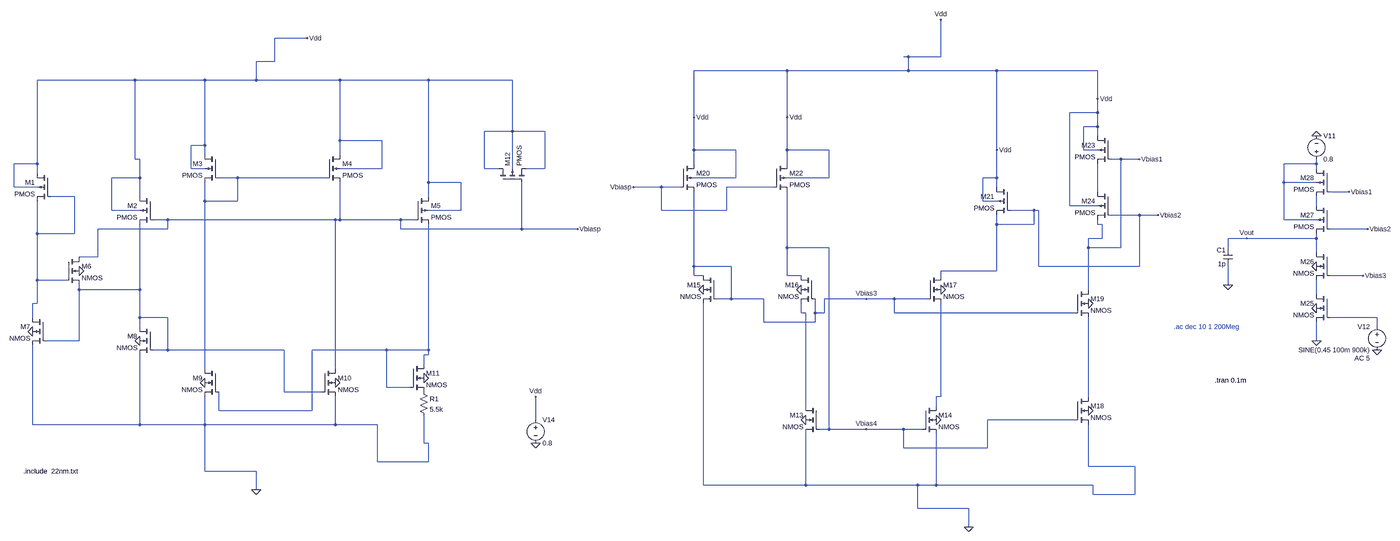
[diagram p0: schematic Project_LTSPICE_22nm.asc, whole sheet]
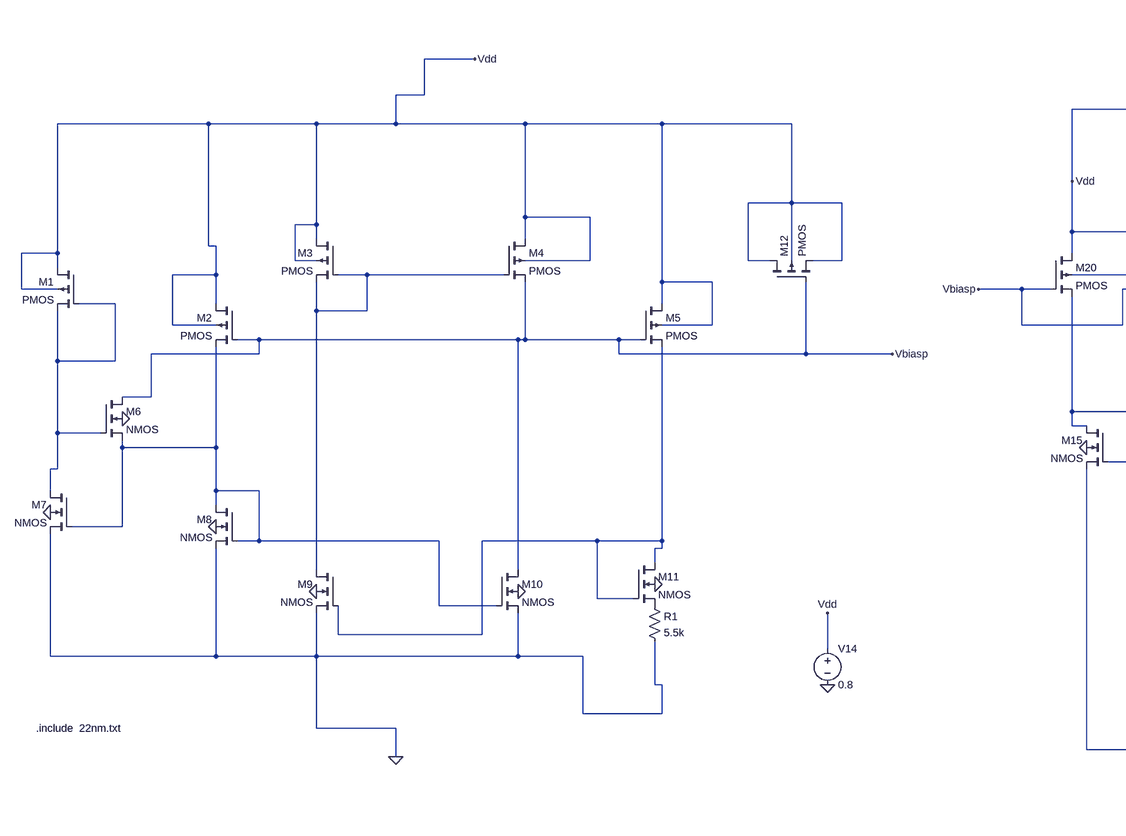
[diagram p1: schematic Project_LTSPICE_22nm.asc, part, row 1 of 1, column 1 of 2]
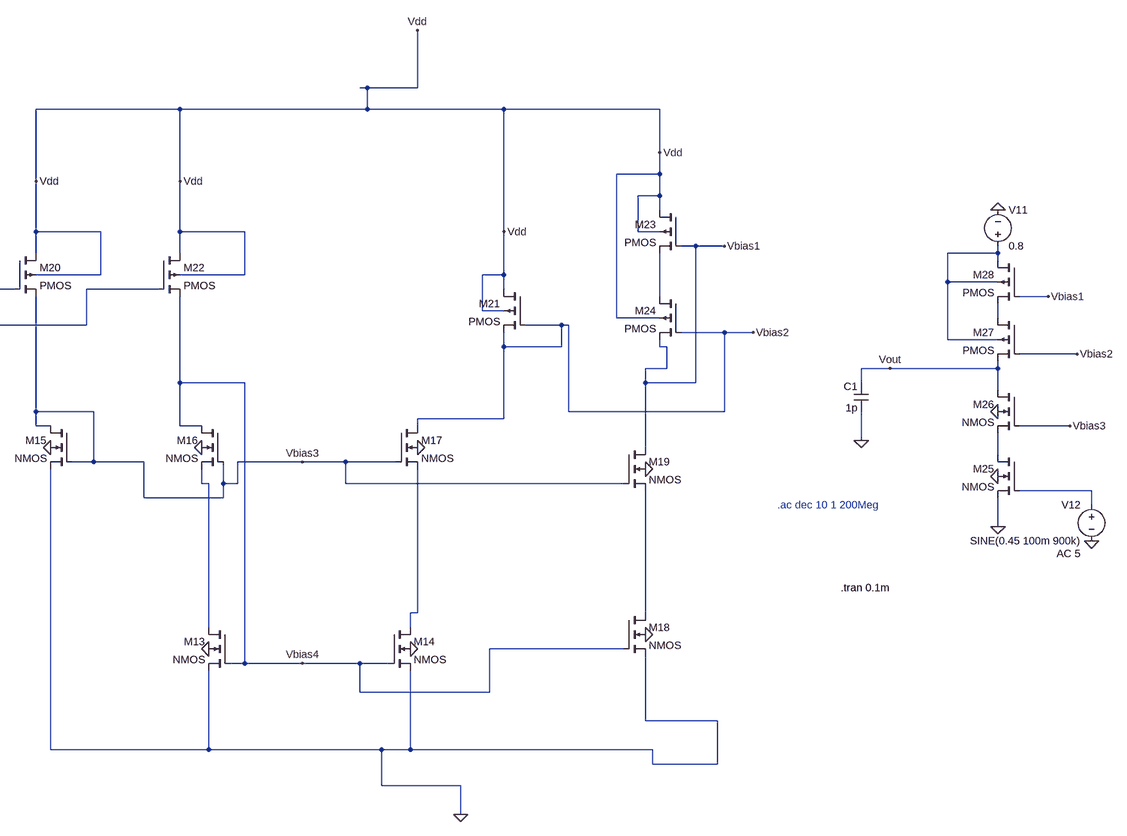
[diagram p2: schematic Project_LTSPICE_22nm.asc, part, row 1 of 1, column 2 of 2]
Project_LTSPICE_22nm.asc, the LTspice schematic file:
Version 4
SHEET 1 6984 1412
WIRE 80 -512 -32 -512
WIRE 2144 -448 2128 -448
WIRE 2256 -448 2256 -576
WIRE 2256 -448 2144 -448
WIRE -32 -432 -32 -512
WIRE -32 -432 -96 -432
WIRE 1728 -400 1408 -400
WIRE 2144 -400 2144 -448
WIRE 2144 -400 1728 -400
WIRE 2448 -400 2144 -400
WIRE 2816 -400 2448 -400
WIRE -512 -368 -848 -368
WIRE -272 -368 -512 -368
WIRE -96 -368 -96 -432
WIRE -96 -368 -272 -368
WIRE 192 -368 -96 -368
WIRE 496 -368 192 -368
WIRE 784 -368 496 -368
WIRE 2816 -304 2816 -400
WIRE 2816 -256 2816 -304
WIRE 2816 -256 2720 -256
WIRE 1408 -240 1408 -400
WIRE 1728 -240 1728 -400
WIRE 2816 -208 2816 -256
WIRE 2816 -208 2768 -208
WIRE 784 -192 784 -368
WIRE 784 -192 688 -192
WIRE 896 -192 784 -192
WIRE 2816 -176 2816 -208
WIRE 192 -160 192 -368
WIRE 336 -160 192 -160
WIRE -272 -144 -272 -368
WIRE -272 -144 -320 -144
WIRE 1408 -128 1408 -240
WIRE 1552 -128 1408 -128
WIRE 1728 -128 1728 -240
WIRE 1872 -128 1728 -128
WIRE 2448 -128 2448 -400
WIRE 2768 -128 2768 -208
WIRE 2816 -128 2768 -128
WIRE -272 -112 -272 -144
WIRE 192 -112 192 -160
WIRE -512 -96 -512 -368
WIRE -496 -96 -512 -96
WIRE 2896 -96 2864 -96
WIRE 2960 -96 2896 -96
WIRE -848 -80 -848 -368
WIRE -848 -80 -928 -80
WIRE 1408 -80 1408 -128
WIRE 1728 -80 1728 -128
WIRE 3568 -80 3568 -96
WIRE 3568 -80 3456 -80
WIRE -320 -64 -320 -144
WIRE -272 -64 -320 -64
WIRE 336 -64 336 -160
WIRE 336 -64 192 -64
WIRE 688 -64 688 -192
WIRE 736 -64 688 -64
WIRE 784 -64 784 -192
WIRE 896 -64 896 -192
WIRE 896 -64 832 -64
WIRE 3568 -64 3568 -80
WIRE -848 -48 -848 -80
WIRE -496 -32 -496 -96
WIRE -496 -32 -592 -32
WIRE -160 -32 -224 -32
WIRE 144 -32 -160 -32
WIRE 1552 -32 1552 -128
WIRE 1552 -32 1408 -32
WIRE 1872 -32 1872 -128
WIRE 1872 -32 1728 -32
WIRE 2448 -32 2448 -128
WIRE 2448 -32 2400 -32
WIRE 496 -16 496 -368
WIRE 608 -16 496 -16
WIRE 3456 -16 3456 -80
WIRE 3568 -16 3456 -16
WIRE -928 0 -928 -80
WIRE -848 0 -928 0
WIRE 1296 0 1200 0
WIRE 1360 0 1296 0
WIRE 1680 0 1520 0
WIRE 2448 0 2448 -32
WIRE 2816 16 2816 -80
WIRE 3680 16 3616 16
WIRE -720 32 -800 32
WIRE -496 32 -496 -32
WIRE 496 32 496 -16
WIRE -272 48 -272 -16
WIRE -160 48 -160 -32
WIRE -160 48 -272 48
WIRE 2400 48 2400 -32
WIRE 2448 48 2400 48
WIRE 2720 64 2720 -256
WIRE 2816 64 2720 64
WIRE 3568 64 3568 32
WIRE -592 80 -592 -32
WIRE -496 80 -592 80
WIRE 608 80 608 -16
WIRE 608 80 496 80
WIRE 1296 80 1296 0
WIRE 1520 80 1520 0
WIRE 1520 80 1296 80
WIRE 2576 80 2496 80
WIRE 2592 80 2576 80
WIRE 2960 96 2864 96
WIRE 3024 96 2960 96
WIRE -400 112 -448 112
WIRE 176 112 -400 112
WIRE 192 112 192 -16
WIRE 192 112 176 112
WIRE 400 112 192 112
WIRE 448 112 400 112
WIRE 3456 112 3456 -16
WIRE 3568 112 3456 112
WIRE 2448 128 2448 96
WIRE 2576 128 2576 80
WIRE 2576 128 2448 128
WIRE 2816 128 2816 112
WIRE 2832 128 2816 128
WIRE -400 144 -400 112
WIRE -400 144 -640 144
WIRE 400 144 400 112
WIRE 816 144 816 -16
WIRE 816 144 400 144
WIRE 1008 144 816 144
WIRE 3744 144 3616 144
WIRE -848 160 -848 48
WIRE -720 160 -720 32
WIRE -720 160 -848 160
WIRE 2832 176 2832 128
WIRE 2832 176 2784 176
WIRE 3328 176 3264 176
WIRE 3568 176 3568 160
WIRE 3568 176 3328 176
WIRE 1728 208 1728 16
WIRE 1872 208 1728 208
WIRE 2784 208 2784 176
WIRE 2896 208 2896 -96
WIRE 2896 208 2784 208
WIRE 3264 208 3264 176
WIRE 3568 224 3568 176
WIRE -640 240 -640 144
WIRE -640 240 -704 240
WIRE 1408 272 1408 16
WIRE 1536 272 1408 272
WIRE 2592 272 2592 80
WIRE 2960 272 2960 96
WIRE 2960 272 2592 272
WIRE 2448 288 2448 128
WIRE 2448 288 2256 288
WIRE 1408 304 1408 272
WIRE 1440 304 1408 304
WIRE 1728 304 1728 208
WIRE 1776 304 1728 304
WIRE 2256 304 2256 288
WIRE 3728 304 3616 304
WIRE -848 320 -848 160
WIRE -752 320 -848 320
WIRE 3264 336 3264 272
WIRE -704 352 -704 336
WIRE -496 352 -496 128
WIRE -496 352 -704 352
WIRE 2784 352 2784 208
WIRE 3568 368 3568 320
WIRE 1536 384 1536 272
WIRE 1536 384 1488 384
WIRE 1648 384 1536 384
WIRE 2000 384 1856 384
WIRE 2096 384 2000 384
WIRE 2208 384 2096 384
WIRE -848 400 -848 320
WIRE -848 400 -864 400
WIRE 1776 432 1776 400
WIRE 1792 432 1776 432
WIRE 1824 432 1824 384
WIRE 1856 432 1856 384
WIRE 1856 432 1824 432
WIRE 2096 432 2096 384
WIRE 2736 432 2096 432
WIRE -864 448 -864 400
WIRE -496 448 -496 352
WIRE -400 448 -496 448
WIRE 3776 448 3616 448
WIRE 1648 464 1648 384
WIRE 1824 464 1824 432
WIRE 1824 464 1648 464
WIRE -496 480 -496 448
WIRE 3776 480 3776 448
WIRE -704 528 -704 352
WIRE -704 528 -816 528
WIRE 3568 528 3568 464
WIRE -400 560 -400 448
WIRE -400 560 -448 560
WIRE 0 560 -400 560
WIRE 352 560 96 560
WIRE 496 560 496 128
WIRE 496 560 352 560
WIRE 496 576 496 560
WIRE 496 576 480 576
WIRE 480 608 480 576
WIRE -272 624 -272 48
WIRE 176 624 176 112
WIRE 352 688 352 560
WIRE 432 688 352 688
WIRE 0 704 0 560
WIRE 128 704 0 704
WIRE 2256 720 2256 400
WIRE 2256 720 2240 720
WIRE 2784 720 2784 448
WIRE 1792 752 1792 432
WIRE 2240 752 2240 720
WIRE -224 768 -224 704
WIRE 96 768 96 560
WIRE 96 768 -224 768
WIRE 864 800 864 720
WIRE 2736 800 2416 800
WIRE -864 816 -864 544
WIRE -496 816 -496 576
WIRE -496 816 -864 816
WIRE -272 816 -272 720
WIRE -272 816 -496 816
WIRE 176 816 176 720
WIRE 176 816 -272 816
WIRE 320 816 176 816
WIRE 1872 832 1872 208
WIRE 1872 832 1840 832
WIRE 2000 832 1872 832
WIRE 2128 832 2000 832
WIRE 2192 832 2128 832
WIRE 480 880 480 784
WIRE 496 880 480 880
WIRE 2128 896 2128 832
WIRE 2416 896 2416 800
WIRE 2416 896 2128 896
WIRE 320 944 320 816
WIRE 496 944 496 880
WIRE 496 944 320 944
WIRE 2784 960 2784 816
WIRE 2944 960 2784 960
WIRE -272 976 -272 816
WIRE -96 976 -272 976
WIRE 1440 1024 1440 400
WIRE 1792 1024 1792 848
WIRE 1792 1024 1440 1024
WIRE 2176 1024 1792 1024
WIRE 2240 1024 2240 848
WIRE 2240 1024 2176 1024
WIRE 2800 1024 2240 1024
WIRE -96 1040 -96 976
WIRE 2800 1056 2800 1024
WIRE 2944 1056 2944 960
WIRE 2944 1056 2800 1056
WIRE 2176 1104 2176 1024
WIRE 2352 1104 2176 1104
WIRE 2352 1168 2352 1104
FLAG -864 496 0
FLAG -496 528 0
FLAG -272 672 0
FLAG 176 672 0
FLAG 480 656 0
FLAG -704 288 0
FLAG 1792 800 0
FLAG 2240 800 0
FLAG 1440 352 0
FLAG 1776 352 0
FLAG 2256 352 0
FLAG 2784 768 0
FLAG 2784 400 0
FLAG 3264 336 0
FLAG 3568 -176 0
FLAG 3776 560 0
FLAG 3568 528 0
FLAG 3328 176 Vout
FLAG 3568 416 0
FLAG 3568 272 0
FLAG 1008 144 Vbiasp
FLAG 1200 0 Vbiasp
FLAG 2000 384 Vbias3
FLAG 2000 832 Vbias4
FLAG 2960 -96 Vbias1
FLAG 3024 96 Vbias2
FLAG 3680 16 Vbias1
FLAG 3744 144 Vbias2
FLAG 3728 304 Vbias3
FLAG 864 880 0
FLAG 864 720 Vdd
FLAG 1408 -240 Vdd
FLAG 1728 -240 Vdd
FLAG 2448 -128 Vdd
FLAG 2816 -304 Vdd
FLAG -96 1040 0
FLAG 2352 1168 0
FLAG 2256 -576 Vdd
FLAG 80 -512 Vdd
SYMBOL pmos4 -800 -48 M0
SYMATTR InstName M1
SYMATTR Value2 l=440n w=220n
SYMBOL pmos4 -448 32 M0
SYMATTR InstName M2
SYMATTR Value2 l=44n w=528n
SYMBOL pmos4 -224 -112 M0
SYMATTR InstName M3
SYMATTR Value2 l=44n w=528n
SYMBOL pmos4 144 -112 R0
SYMATTR InstName M4
SYMATTR Value2 l=44n w=528n
SYMBOL pmos4 448 32 R0
SYMATTR InstName M5
SYMATTR Value2 l=44n w=528n
SYMBOL nmos4 -752 240 R0
SYMATTR InstName M6
SYMATTR Value2 l=44n w=88n
SYMBOL nmos4 -816 448 M0
SYMATTR InstName M7
SYMATTR Value2 l=44n w=220n
SYMBOL nmos4 -448 480 M0
SYMATTR InstName M8
SYMATTR Value2 l=44n w=220n
SYMBOL nmos4 -224 624 M0
SYMATTR InstName M9
SYMATTR Value2 l=44n w=220n
SYMBOL nmos4 128 624 R0
SYMATTR InstName M10
SYMATTR Value2 l=44n w=220n
SYMBOL nmos4 432 608 R0
SYMATTR InstName M11
SYMATTR Value2 l=44n w=660n
SYMBOL pmos4 736 -16 R270
SYMATTR InstName M12
SYMATTR Value2 l=1100n w=1100n
SYMBOL res 464 688 R0
SYMATTR InstName R1
SYMATTR Value 5.5k
SYMBOL nmos4 1840 752 M0
SYMATTR InstName M13
SYMATTR Value2 l=22n w=110n
SYMBOL nmos4 2192 752 R0
SYMATTR InstName M14
SYMATTR Value2 l=22n w=110n
SYMBOL nmos4 1488 304 M0
SYMATTR InstName M15
SYMATTR Value2 l=22n w=55n
SYMBOL nmos4 1824 304 M0
SYMATTR InstName M16
SYMATTR Value2 l=22n w=110n
SYMBOL nmos4 2208 304 R0
SYMATTR InstName M17
SYMATTR Value2 l=22n w=110n
SYMBOL nmos4 2736 720 R0
SYMATTR InstName M18
SYMATTR Value2 l=22n w=110n
SYMBOL nmos4 2736 352 R0
SYMATTR InstName M19
SYMATTR Value2 l=22n w=110n
SYMBOL pmos4 1360 -80 R0
SYMATTR InstName M20
SYMATTR Value2 l=22n w=264n
SYMBOL pmos4 2496 0 M0
SYMATTR InstName M21
SYMATTR Value2 l=22n w=88n
SYMBOL pmos4 1680 -80 R0
SYMATTR InstName M22
SYMATTR Value2 l=22n w=264n
SYMBOL pmos4 2864 -176 M0
SYMATTR InstName M23
SYMATTR Value2 l=22n w=264n
SYMBOL pmos4 2864 16 M0
SYMATTR InstName M24
SYMATTR Value2 l=22n w=264n
SYMBOL voltage 3568 -80 M180
WINDOW 0 24 96 Left 2
WINDOW 3 24 16 Left 2
WINDOW 123 0 0 Left 0
WINDOW 39 0 0 Left 0
SYMATTR InstName V11
SYMATTR Value 0.8
SYMBOL voltage 3776 464 M0
WINDOW 123 24 124 Left 2
WINDOW 39 0 0 Left 0
SYMATTR Value2 AC 5
SYMATTR InstName V12
SYMATTR Value SINE(0.45 100m 900k)
SYMBOL cap 3280 208 M0
SYMATTR InstName C1
SYMATTR Value 1p
SYMBOL nmos4 3616 368 M0
SYMATTR InstName M25
SYMATTR Value2 l=22n w=330n
SYMBOL nmos4 3616 224 M0
SYMATTR InstName M26
SYMATTR Value2 l=22n w=330n
SYMBOL pmos4 3616 64 M0
SYMATTR InstName M27
SYMATTR Value2 l=22n w=500n
SYMBOL pmos4 3616 -64 M0
SYMATTR InstName M28
SYMATTR Value2 l=22n w=590n
SYMBOL voltage 864 784 R0
WINDOW 123 0 0 Left 0
WINDOW 39 0 0 Left 0
SYMATTR InstName V14
SYMATTR Value 0.8
TEXT 3304 480 Right 2 ;.ac dec 10 1 200Meg
TEXT 3328 664 Right 2 !.tran 0.1m
TEXT -896 976 Left 2 !.include  22nm.txt

The netlist it stands for:
* Project_LTSPICE_22nm.asc
M1 Vdd N004 N004 Vdd PMOS l=440n w=220n
M2 Vdd Vbiasp N006 Vdd PMOS l=44n w=528n
M3 Vdd N002 N002 Vdd PMOS l=44n w=528n
M4 Vdd N002 Vbiasp Vdd PMOS l=44n w=528n
M5 Vdd Vbiasp N010 Vdd PMOS l=44n w=528n
M6 Vbiasp N004 N006 0 NMOS l=44n w=88n
M7 N004 N006 0 0 NMOS l=44n w=220n
M8 N006 N006 0 0 NMOS l=44n w=220n
M9 N002 N010 0 0 NMOS l=44n w=220n
M10 Vbiasp N006 0 0 NMOS l=44n w=220n
M11 N010 N010 P001 0 NMOS l=44n w=660n
M12 Vdd Vbiasp Vdd Vdd PMOS l=1100n w=1100n
R1 P001 0 5.5k
M13 N008 Vbias4 0 0 NMOS l=22n w=110n
M14 N011 Vbias4 0 0 NMOS l=22n w=110n
M15 Vbias3 Vbias3 0 0 NMOS l=22n w=55n
M16 Vbias4 Vbias3 N008 0 NMOS l=22n w=110n
M17 Vbias2 Vbias3 N011 0 NMOS l=22n w=110n
M18 N012 Vbias4 0 0 NMOS l=22n w=110n
M19 Vbias1 Vbias3 N012 0 NMOS l=22n w=110n
M20 Vdd Vbiasp Vbias3 Vdd PMOS l=22n w=264n
M21 Vdd Vbias2 Vbias2 Vdd PMOS l=22n w=88n
M22 Vdd Vbiasp Vbias4 Vdd PMOS l=22n w=264n
M23 Vdd Vbias1 N003 Vdd PMOS l=22n w=264n
M24 N003 Vbias2 Vbias1 Vdd PMOS l=22n w=264n
V11 N001 0 0.8
V12 N009 0 SINE(0.45 100m 900k) AC 5
C1 Vout 0 1p
M25 N007 N009 0 0 NMOS l=22n w=330n
M26 Vout Vbias3 N007 0 NMOS l=22n w=330n
M27 N005 Vbias2 Vout N001 PMOS l=22n w=500n
M28 N001 Vbias1 N005 N001 PMOS l=22n w=590n
V14 Vdd 0 0.8
.model NMOS NMOS
.model PMOS PMOS
.lib standard.mos
* .ac dec 10 1 200Meg
.tran 0.1m
.include  22nm.txt
.backanno
.end